# Altium schematic sheet charger.SchDoc: Charger
size A4; Organization: GPA Robotics; DocumentNumber: 6; Revision: REV 0; SheetNumber: 6; SheetTotal: 12
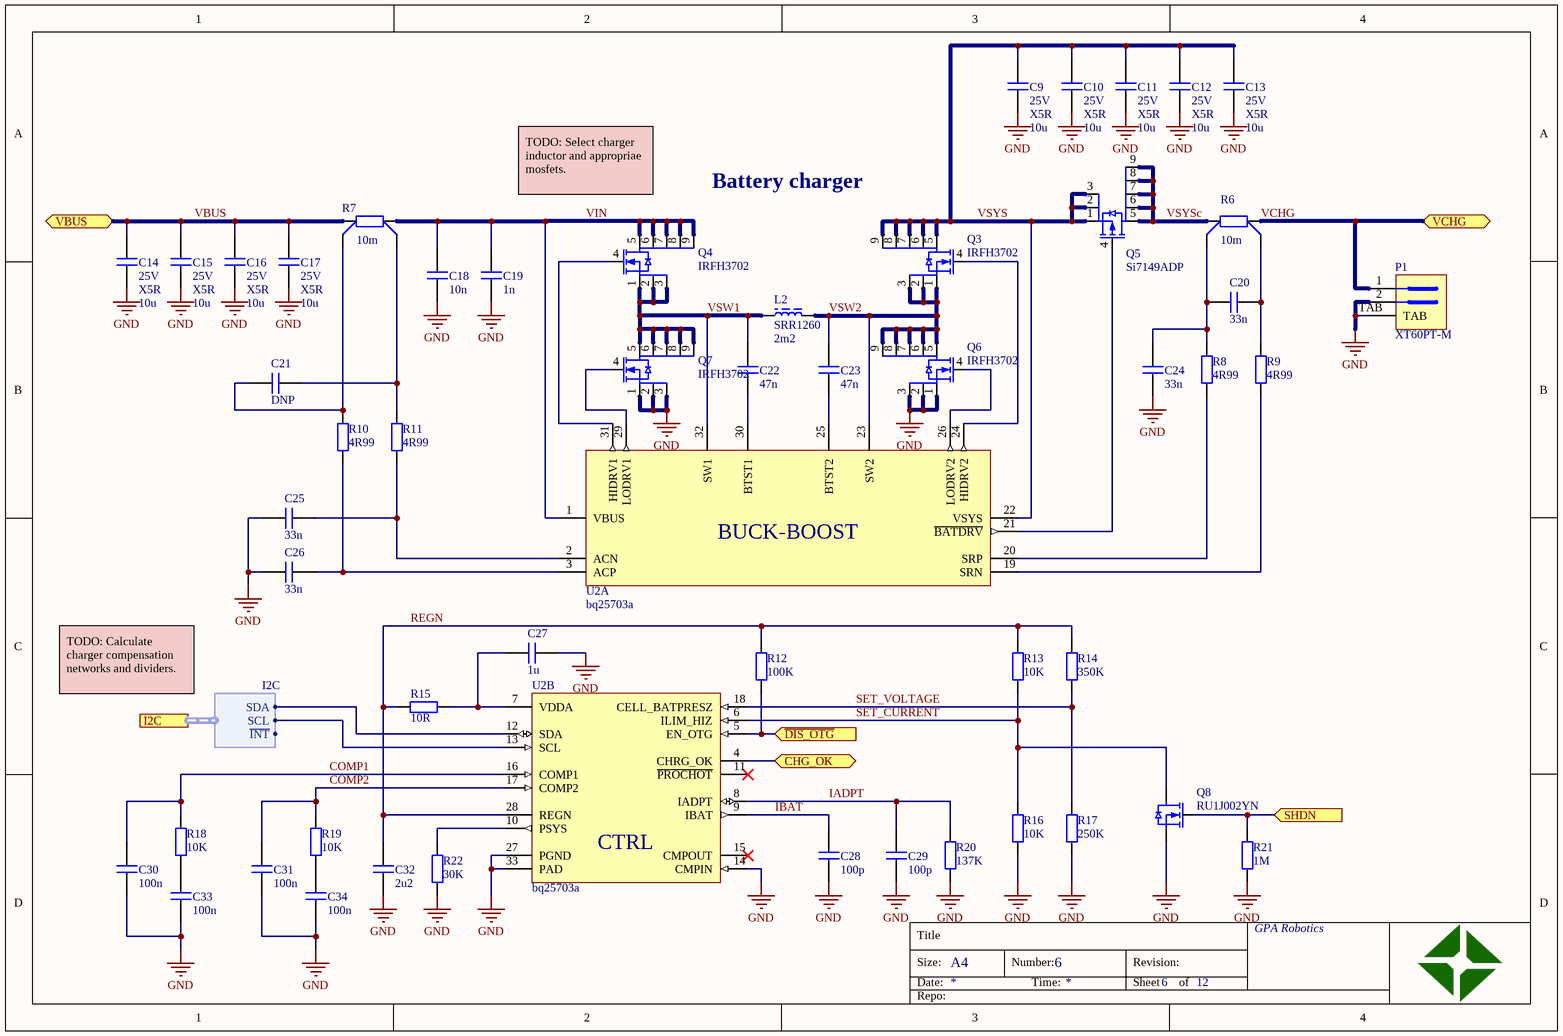
[diagram p0: charger.SchDoc]

## Parts
C9  value 10u  voltage: 25V  type: X5R  [CAPC3216X14N]  (hidden comment: cap)
C10  value 10u  voltage: 25V  type: X5R  [CAPC3216X14N]  (hidden comment: cap)
C11  value 10u  voltage: 25V  type: X5R  [CAPC3216X14N]  (hidden comment: cap)
C12  value 10u  voltage: 25V  type: X5R  [CAPC3216X14N]  (hidden comment: cap)
C13  value 10u  voltage: 25V  type: X5R  [CAPC3216X14N]  (hidden comment: cap)
C14  value 10u  voltage: 25V  type: X5R  [CAPC3216X14N]  (hidden comment: cap)
C15  value 10u  voltage: 25V  type: X5R  [CAPC3216X14N]  (hidden comment: cap)
C16  value 10u  voltage: 25V  type: X5R  [CAPC3216X14N]  (hidden comment: cap)
C17  value 10u  voltage: 25V  type: X5R  [CAPC3216X14N]  (hidden comment: cap)
C18  value 10n  [CAPC1005X06N]  (hidden comment: cap)
C19  value 1n  [CAPC1005X06N]  (hidden comment: cap)
C20  value 33n  [CAPC1005X06N]  (hidden comment: cap)
C21  value DNP  [CAPC1005X06N]  (hidden comment: cap)
C22  value 47n  [CAPC1005X06N]  (hidden comment: cap)
C23  value 47n  [CAPC1005X06N]  (hidden comment: cap)
C24  value 33n  [CAPC1005X06N]  (hidden comment: cap)
C25  value 33n  [CAPC1005X06N]  (hidden comment: cap)
C26  value 33n  [CAPC1005X06N]  (hidden comment: cap)
C27  value 1u  [CAPC2012X11N]  (hidden comment: cap)
C28  value 100p  [CAPC1005X06N]  (hidden comment: cap)
C29  value 100p  [CAPC1005X06N]  (hidden comment: cap)
C30  value 100n  [CAPC1005X06N]  (hidden comment: cap)
C31  value 100n  [CAPC1005X06N]  (hidden comment: cap)
C32  value 2u2  [CAPC2012X11N]  (hidden comment: cap)
C33  value 100n  [CAPC1005X06N]  (hidden comment: cap)
C34  value 100n  [CAPC1005X06N]  (hidden comment: cap)
L2  SRR1260  value 2m2  [SRR1260]
P1  XT60PT-M  [XT60PT-M]
Q3  IRFH3702  [PQFN67P300X300X100-8N]
Q4  IRFH3702  [PQFN67P300X300X100-8N]
Q5  Si7149ADP  [SON127P620X112_HS-9N_POWERPAK_SO8]
Q6  IRFH3702  [PQFN67P300X300X100-8N]
Q7  IRFH3702  [PQFN67P300X300X100-8N]
Q8  RU1J002YN  [SOTFL65P210X105-3N]
R6  value 10m  [4T_RESC1632X05N]  (hidden comment: res_4t)
R7  value 10m  [4T_RESC1632X05N]  (hidden comment: res_4t)
R8  value 4R99  [RESC1005X04N]  (hidden comment: res)
R9  value 4R99  [RESC1005X04N]  (hidden comment: res)
R10  value 4R99  [RESC1005X04N]  (hidden comment: res)
R11  value 4R99  [RESC1005X04N]  (hidden comment: res)
R12  value 100K  [RESC1005X04N]  (hidden comment: res)
R13  value 10K  [RESC1005X04N]  (hidden comment: res)
R14  value 350K  [RESC1005X04N]  (hidden comment: res)
R15  value 10R  [RESC1005X04N]  (hidden comment: res)
R16  value 10K  [RESC1005X04N]  (hidden comment: res)
R17  value 250K  [RESC1005X04N]  (hidden comment: res)
R18  value 10K  [RESC1005X04N]  (hidden comment: res)
R19  value 10K  [RESC1005X04N]  (hidden comment: res)
R20  value 137K  [RESC1005X04N]  (hidden comment: res)
R21  value 1M  [RESC1005X04N]  (hidden comment: res)
R22  value 30K  [RESC1005X04N]  (hidden comment: res)
U2  bq25703a  [QFN40P400X400X80_HS-33N_BQ25703A]  (parts A,B of 2)

## Ports
CHG_OK (bidir), I2C (harness I2C), SHDN (in), VBUS (bidir), VCHG (bidir), ~{DIS_OTG} (in)

## Harnesses
I2C: SDA, SCL, ~{INT}

## Nets
GND: C9.1 C10.1 C11.1 C12.1 C13.1 C14.1 C15.1 C16.1 C17.1 C18.1 C19.1 C24.1 C25.2 C26.2 C27.2 C28.1 C29.1 C30.1 C31.1 C32.1 C33.1 C34.1 P1.2 P1.TAB Q6.1(S) Q6.2(S) Q6.3(S) Q7.1(S) Q7.2(S) Q7.3(S) Q8.2(S) R16.1 R17.1 R20.1 R21.1 R22.1 U2.14(CMPIN) U2.27(PGND) U2.33(PAD)
~{DIS_OTG}: R12.1 U2.5(EN_OTG) ; port ~{DIS_OTG}
CHG_OK: U2.4(CHRG_OK) ; port CHG_OK
COMP1: C30.2 R18.2 U2.16(COMP1)
COMP2: C31.2 R19.2 U2.17(COMP2)
IADPT: C29.2 R20.2 U2.8(IADPT)
IBAT: C28.2 U2.9(IBAT)
REGN: C32.2 R12.2 R13.2 R14.2 R15.1 U2.28(REGN)
SET_CURRENT: Q8.3(D) R13.1 R16.2 U2.6(ILIM_HIZ)
SET_VOLTAGE: R14.1 R17.2 U2.18(CELL_BATPRESZ)
SHDN: Q8.1(G) R21.2 ; port SHDN
VBUS: C14.2 C15.2 C16.2 C17.2 R7.1 ; port VBUS
VCHG: P1.1 R6.1 ; port VCHG
VIN: C18.2 C19.2 Q4.5(D) Q4.6(D) Q4.7(D) Q4.8(D) Q4.9(D) R7.2 U2.1(VBUS)
VSW1: C22.2 L2.1 Q4.1(S) Q4.2(S) Q4.3(S) Q7.5(D) Q7.6(D) Q7.7(D) Q7.8(D) Q7.9(D) U2.32(SW1)
VSW2: C23.2 L2.2 Q3.1(S) Q3.2(S) Q3.3(S) Q6.5(D) Q6.6(D) Q6.7(D) Q6.8(D) Q6.9(D) U2.23(SW2)
VSYS: C9.2 C10.2 C11.2 C12.2 C13.2 Q3.5(D) Q3.6(D) Q3.7(D) Q3.8(D) Q3.9(D) Q5.1(S) Q5.2(S) Q5.3(S) U2.22(VSYS)
VSYSc: Q5.5(D) Q5.6(D) Q5.7(D) Q5.8(D) Q5.9(D) R6.2
NetC20_1: C20.1 R6.3 R9.2
NetC20_2: C20.2 C24.2 R6.4 R8.2
NetC21_1: C21.1 R7.4 R11.2
NetC21_2: C21.2 R7.3 R10.2
NetC22_1: C22.1 U2.30(BTST1)
NetC23_1: C23.1 U2.25(BTST2)
NetC25_1: C25.1 R11.1 U2.2(ACN)
NetC26_1: C26.1 R10.1 U2.3(ACP)
NetC27_1: C27.1 R15.2 U2.7(VDDA)
NetC33_2: C33.2 R18.1
NetC34_2: C34.2 R19.1
NetQ3_4: Q3.4(G) U2.24(HIDRV2)
NetQ4_4: Q4.4(G) U2.31(HIDRV1)
NetQ5_4: Q5.4(G) U2.21(~{BATDRV})
NetQ6_4: Q6.4(G) U2.26(LODRV2)
NetQ7_4: Q7.4(G) U2.29(LODRV1)
NetR8_1: R8.1 U2.20(SRP)
NetR9_1: R9.1 U2.19(SRN)
NetR22_2: R22.2 U2.10(PSYS)
NetU2_12: U2.12(SDA) ; port I2C.SDA
NetU2_13: U2.13(SCL) ; port I2C.SCL

Not connected (* = marked no-connect by the designer): U2 11(~{PROCHOT})* 15(CMPOUT)*

## Notes on the sheet
- Battery charger
- TODO: Select charger inductor and appropriae mosfets.
- TODO: Calculate charger compensation networks and dividers.
- Title
- Size:
- Date:
- A4
- Number:
- Time:
- Revision:
- Sheet
- of
- Repo:
- (in symbol bq25703a, part A) BUCK-BOOST
- (in symbol bq25703a, part B) CTRL

## Library data of the parts
C9-C34 = cap: Capacitor; #digikey: *; #mouser: *
  C18-C34: voltage: *; type: *
Q3 Q4 Q6 Q7 = irfh3702: HEXFET Power MOSFET; ComponentLink1Description: datasheet; ComponentLink1URL: https://www.infineon.com/dgdl/irfh3702pbf.pdf?fileId=5546d462533600a40153561a25871e76
Q5 = si7149adp: P-Channel 30 V (D-S) MOSFET; ComponentLink1Description: datasheet; ComponentLink1URL: http://www.vishay.com/docs/62839/si7149adp.pdf
Q8 = ru1j002yn: N-channel 50V 200mA Small signal MOSFET; ComponentLink1Description: datasheet; ComponentLink1URL: https://www.mouser.se/datasheet/2/348/ru1j002yn-e-1018335.pdf
R6 R7 = res_4t: Resistor; power: *; #digikey: *; #mouser: *
R8-R22 = res: Resistor; power: *; voltage: *; #digikey: *; #mouser: *
U2 = bq25703a: I2C Multi-Chemistry Battery Buck-Boost Charge Controller With System Power Monitor and Processor Hot Monitor; ComponentLink1Description: datasheet; ComponentLink1URL: http://www.ti.com/lit/ds/symlink/bq25703a.pdf
L2 = srr1260: ComponentLink1Description: series; ComponentLink1URL: https://www.bourns.com/docs/Product-Datasheets/SRR1260.pdf